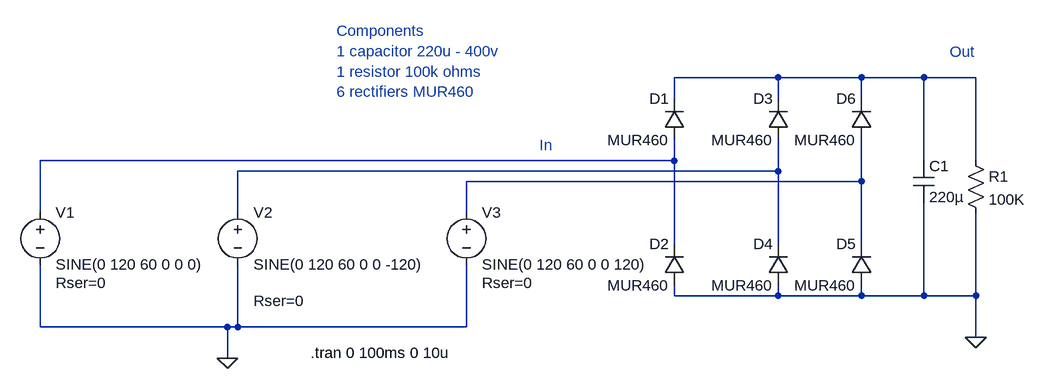
[diagram p0: schematic Draft3.asc]
Draft3.asc, the LTspice schematic file:
Version 4.1
SHEET 1 1608 680
WIRE 720 -48 560 -48
WIRE 848 -48 720 -48
WIRE 944 -48 848 -48
WIRE 1024 -48 944 -48
WIRE 560 -16 560 -48
WIRE 720 -16 720 -48
WIRE 848 -16 848 -48
WIRE 560 80 560 48
WIRE 560 80 -416 80
WIRE 944 80 944 -48
WIRE 1024 80 1024 -48
WIRE 720 96 720 48
WIRE 720 96 -112 96
WIRE 848 112 848 48
WIRE 848 112 240 112
WIRE -416 160 -416 80
WIRE -112 160 -112 96
WIRE 240 160 240 112
WIRE 560 208 560 80
WIRE 720 208 720 96
WIRE 848 208 848 112
WIRE 560 288 560 272
WIRE 720 288 720 272
WIRE 720 288 560 288
WIRE 848 288 848 272
WIRE 848 288 720 288
WIRE 944 288 944 144
WIRE 944 288 848 288
WIRE 1024 288 1024 160
WIRE 1024 288 944 288
WIRE -416 336 -416 240
WIRE -128 336 -416 336
WIRE -112 336 -112 240
WIRE -112 336 -128 336
WIRE 240 336 240 240
WIRE 240 336 -112 336
WIRE 1024 352 1024 288
WIRE -128 384 -128 336
FLAG -128 384 0
FLAG 1024 352 0
SYMBOL voltage -416 144 R0
WINDOW 123 0 0 Left 0
WINDOW 39 24 124 Left 2
SYMATTR SpiceLine Rser=0
SYMATTR InstName V1
SYMATTR Value SINE(0 120 60 0 0 0)
SYMBOL voltage -112 144 R0
WINDOW 123 24 124 Left 2
WINDOW 39 24 152 Left 2
SYMATTR SpiceLine Rser=0
SYMATTR InstName V2
SYMATTR Value SINE(0 120 60 0 0 -120)
SYMBOL voltage 240 144 R0
WINDOW 123 0 0 Left 0
WINDOW 39 24 124 Left 2
SYMATTR SpiceLine Rser=0
SYMATTR InstName V3
SYMATTR Value SINE(0 120 60 0 0 120)
SYMBOL diode 576 48 R180
WINDOW 0 24 64 Left 2
WINDOW 3 24 0 Left 2
SYMATTR InstName D1
SYMATTR Value MUR460
SYMBOL diode 576 272 R180
WINDOW 0 24 64 Left 2
WINDOW 3 24 0 Left 2
SYMATTR InstName D2
SYMATTR Value MUR460
SYMBOL diode 736 48 R180
WINDOW 0 24 64 Left 2
WINDOW 3 24 0 Left 2
SYMATTR InstName D3
SYMATTR Value MUR460
SYMBOL diode 736 272 R180
WINDOW 0 24 64 Left 2
WINDOW 3 24 0 Left 2
SYMATTR InstName D4
SYMATTR Value MUR460
SYMBOL diode 864 272 R180
WINDOW 0 24 64 Left 2
WINDOW 3 24 0 Left 2
SYMATTR InstName D5
SYMATTR Value MUR460
SYMBOL diode 864 48 R180
WINDOW 0 24 64 Left 2
WINDOW 3 24 0 Left 2
SYMATTR InstName D6
SYMATTR Value MUR460
SYMBOL res 1008 64 R0
SYMATTR InstName R1
SYMATTR Value 100K
SYMATTR SpiceLine tol=1 pwr=0.1
SYMBOL cap 928 80 R0
SYMATTR Value 220µ
SYMATTR InstName C1
SYMATTR SpiceLine V=400 Irms=3.22 Rser=0.1295 Lser=10.037n
TEXT 0 376 Left 2 !.tran 0 100ms 0 10u
TEXT 40 -120 Left 2 ;Components\n1 capacitor 220u - 400v\n1 resistor 100k ohms\n6 rectifiers MUR460
TEXT 352 56 Left 2 ;In
TEXT 984 -88 Left 2 ;Out

The netlist it stands for:
* Draft3.asc
V1 N002 0 SINE(0 120 60 0 0 0) Rser=0
V2 N003 0 SINE(0 120 60 0 0 -120) Rser=0
V3 N004 0 SINE(0 120 60 0 0 120) Rser=0
D1 N002 N001 MUR460
D2 0 N002 MUR460
D3 N003 N001 MUR460
D4 0 N003 MUR460
D5 0 N004 MUR460
D6 N004 N001 MUR460
R1 N001 0 100K tol=1 pwr=0.1
C1 N001 0 220µ V=400 Irms=3.22 Rser=0.1295 Lser=10.037n
.model D D
.lib standard.dio
.tran 0 100ms 0 10u
* Components
* 1 capacitor 220u - 400v
* 1 resistor 100k ohms
* 6 rectifiers MUR460
* In
* Out
.backanno
.end